# Altium schematic sheet DAC.SchDoc
size A4; SheetNumber: 4; SheetTotal: 10
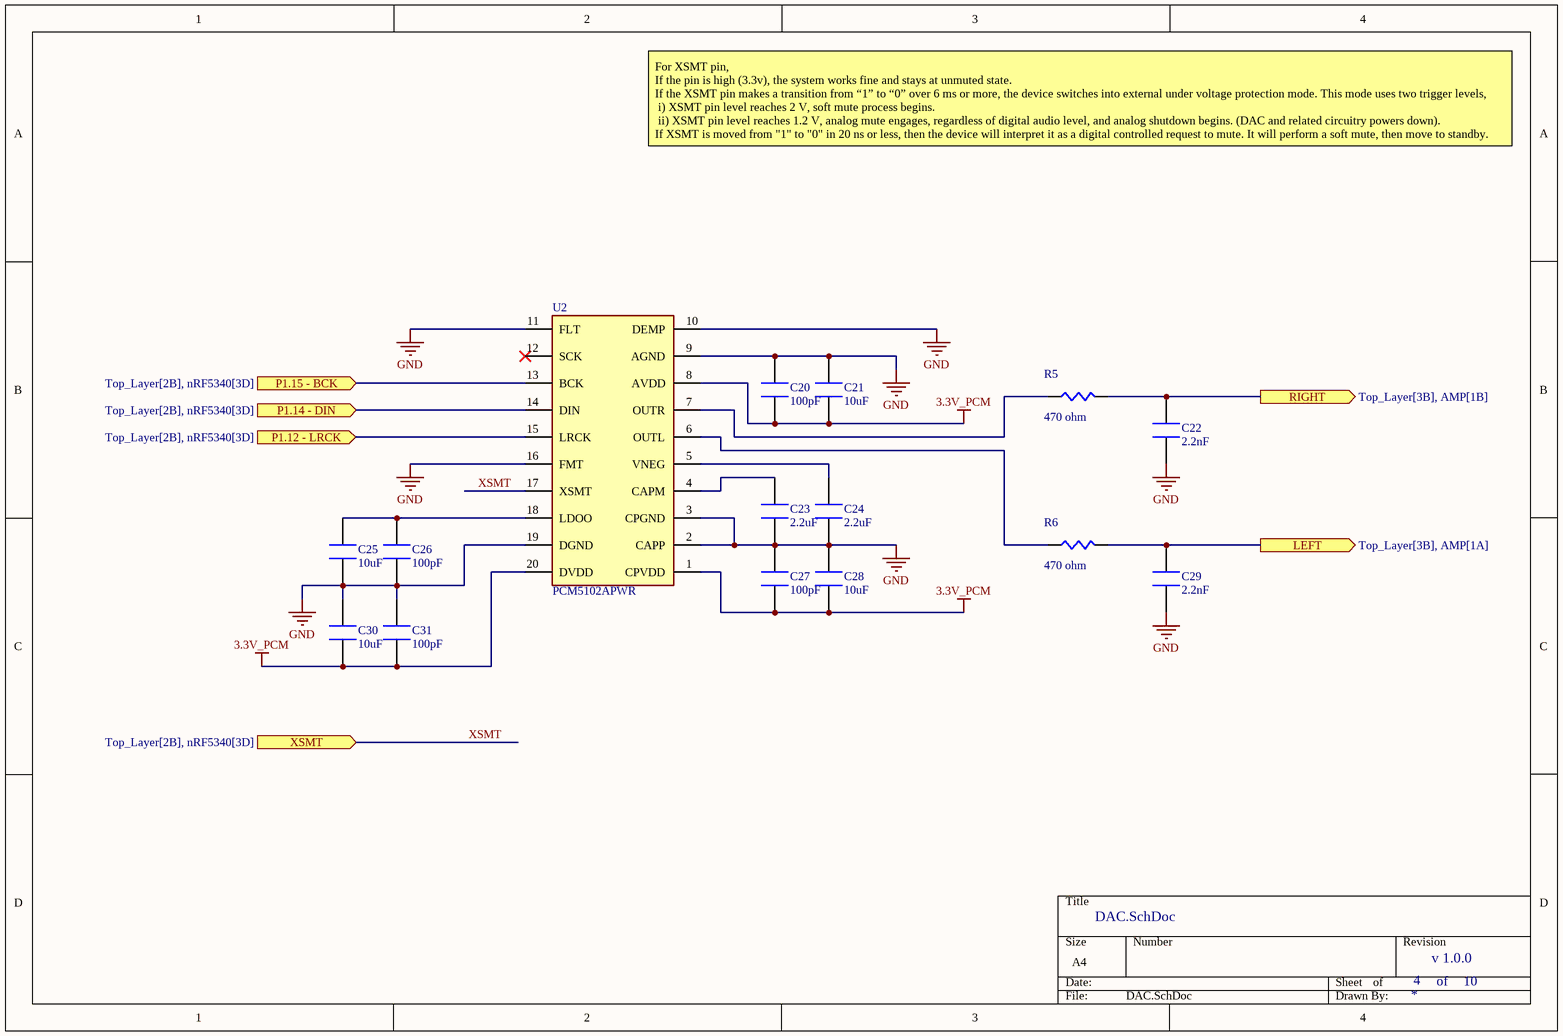
[diagram p0: DAC.SchDoc]

## Parts
C20  100pF  [CAPC0603X8N]
C21  10uF  [CAPC0805X14N]
C22  2.2nF  [CAPC0603X8N]
C23  2.2uF  [CAP0805X13N]
C24  2.2uF  [CAP0805X13N]
C25  10uF  [CAPC0805X14N]
C26  100pF  [CAPC0603X8N]
C27  100pF  [CAPC0603X8N]
C28  10uF  [CAPC0805X14N]
C29  2.2nF  [CAPC0603X8N]
C30  10uF  [CAPC0805X14N]
C31  100pF  [CAPC0603X8N]
R5  470 ohm  [RECS0603X45N]
R6  470 ohm  [RECS0603X45N]
U2  PCM5102APWR  [SOP65P640X120-20N]

## Ports
LEFT (out, see Top_Layer[3B], AMP[1A]), P1.12 - LRCK (in, see Top_Layer[2B], nRF5340[3D]), P1.14 - DIN (in, see Top_Layer[2B], nRF5340[3D]), P1.15 - BCK (in, see Top_Layer[2B], nRF5340[3D]), RIGHT (out, see Top_Layer[3B], AMP[1B]), XSMT (in, see Top_Layer[2B], nRF5340[3D])

## Nets
3.3V_PCM: C20.1 C21.1 C27.1 C28.1 C30.1 C31.1 U2.1(CPVDD) U2.8(AVDD) U2.20(DVDD)
GND: C20.2 C21.2 C22.1 C23.1 C24.1 C25.1 C26.1 C27.2 C28.2 C29.1 C30.2 C31.2 U2.2(CAPP) U2.3(CPGND) U2.9(AGND) U2.10(DEMP) U2.11(FLT) U2.16(FMT) U2.19(DGND)
LEFT: C29.2 R6.2 ; port LEFT
P1.12 - LRCK: U2.15(LRCK) ; port P1.12 - LRCK
P1.14 - DIN: U2.14(DIN) ; port P1.14 - DIN
P1.15 - BCK: U2.13(BCK) ; port P1.15 - BCK
RIGHT: C22.2 R5.2 ; port RIGHT
XSMT: U2.17(XSMT) ; port XSMT
NetC23_2: C23.2 U2.4(CAPM)
NetC24_2: C24.2 U2.5(VNEG)
NetC25_2: C25.2 C26.2 U2.18(LDOO)
NetR5_1: R5.1 U2.7(OUTR)
NetR6_1: R6.1 U2.6(OUTL)

Not connected (* = marked no-connect by the designer): U2 12(SCK)*

## Notes on the sheet
- For XSMT pin,
  If the pin is high (3.3v), the system works fine and stays at unmuted state.
  If the XSMT pin makes a transition from “1” to “0” over 6 ms or more, the device switches into external under voltage protection mode. This mode uses two trigger levels,
  i) XSMT pin level reaches 2 V, soft mute process begins.
  ii) XSMT pin level reaches 1.2 V, analog mute engages, regardless of digital audio level, and analog shutdown begins. (DAC and related circuitry powers down).
  If XSMT is moved from "1" to "0" in 20 ns or less, then the device will interpret it as a digital controlled request to mute. It will perform a soft mute, then move to standby.
- v 1.0.0
- of

## Library data of the parts
C20 C26 C27 C31 = CC0603_100pF_X7R: C14663 ,CC0603KRX7R9BB104, 100nF 50V X7R ±10% 0603 Multilayer Ceramic Capacitors MLCC - SMD/SMT ROHS; Supplier 1: Avnet; Supplier Part Number 1: CC0603KRX7R9BB104
C21 C25 C28 C30 = CC0805_10uF_X7R: C95841, CL21B106KOQNNNE, 10uF 16V X7R ±10% 0805 Multilayer Ceramic Capacitors MLCC - SMD/SMT ROHS; Supplier 1: Avnet; Supplier Part Number 1: CL21B106KOQNNNE
C22 C29 = CC0603_2.2nF_NPO: C107043, CC0603JRNPO9BN222, 2.2nF 50V NP0 ±5% 0603 Multilayer Ceramic Capacitors MLCC - SMD/SMT ROHS; Supplier 1: Arrow Electronics; Supplier Part Number 1: CC0603JRNPO9BN222
C23 C24 = CC0805_2.2uF_X7R: C19110 ,CL21B225KAFNNNE, 2.2uF 25V X7R ±10% 0805 Multilayer Ceramic Capacitors MLCC - SMD/SMT ROHS; Supplier 1: Avnet; Supplier Part Number 1: CL21B225KAFNNNE
R5 R6 = RESC0603_470_THIN: C705857,RT0603BRE07470RL, -55℃~+155℃ 100mW 470Ω 75V Thin Film Resistor ±0.1% ±50ppm/℃ 0603 Chip Resistor - Surface Mount ROHS; Supplier 1: Arrow Electronics; Supplier Part Number 1: RT0603BRE07470RL
U2 = PCM5102APWR: C107671, PCM5102APWR, -25℃~+85℃ 1.8V~3.3V 2 32 384kHz 500uA 50MHz Audio Decoder I2S TSSOP-20 ADCs/DACs - Special Purpose ROHS; Manufacturer_Name: Texas Instruments; Datasheet Link: https://componentsearchengine.com/Datasheets/2/PCM5102APWR.pdf; Height: 1.2mm; Manufacturer_Part_Number: PCM5102APWR; Mouser Part Number: 595-PCM5102APWR; Mouser Price/Stock: https://www.mouser.co.uk/ProductDetail/Texas-Instruments/PCM5102APWR?qs=E2%2FxqS9xjzrfECkwEYoiyg%3D%3D; Arrow Part Number: PCM5102APWR; Arrow Price/Stock: https://www.arrow.com/en/products/pcm5102apwr/texas-instruments?utm_currency=USD&region=nac; Supplier 1: DigiKey; Supplier Part Number 1: 296-36707-1-ND